# Altium schematic sheet ESP32_Dash_FCEM.SchDoc: Dashboard
size 594 x 420 mm; Date: 04/09/2021; Author: Mario Venere Neto; CompanyName: Formula CEM; DrawnBy: Mario Venere Neto; DocumentNumber: 1.0; Revision: 0; SheetNumber: 1; SheetTotal: 1; Time: 12:05; ImagePath: C:\Users\Lenovo\Documents\ESP32_Dash\SCH_Logo.png
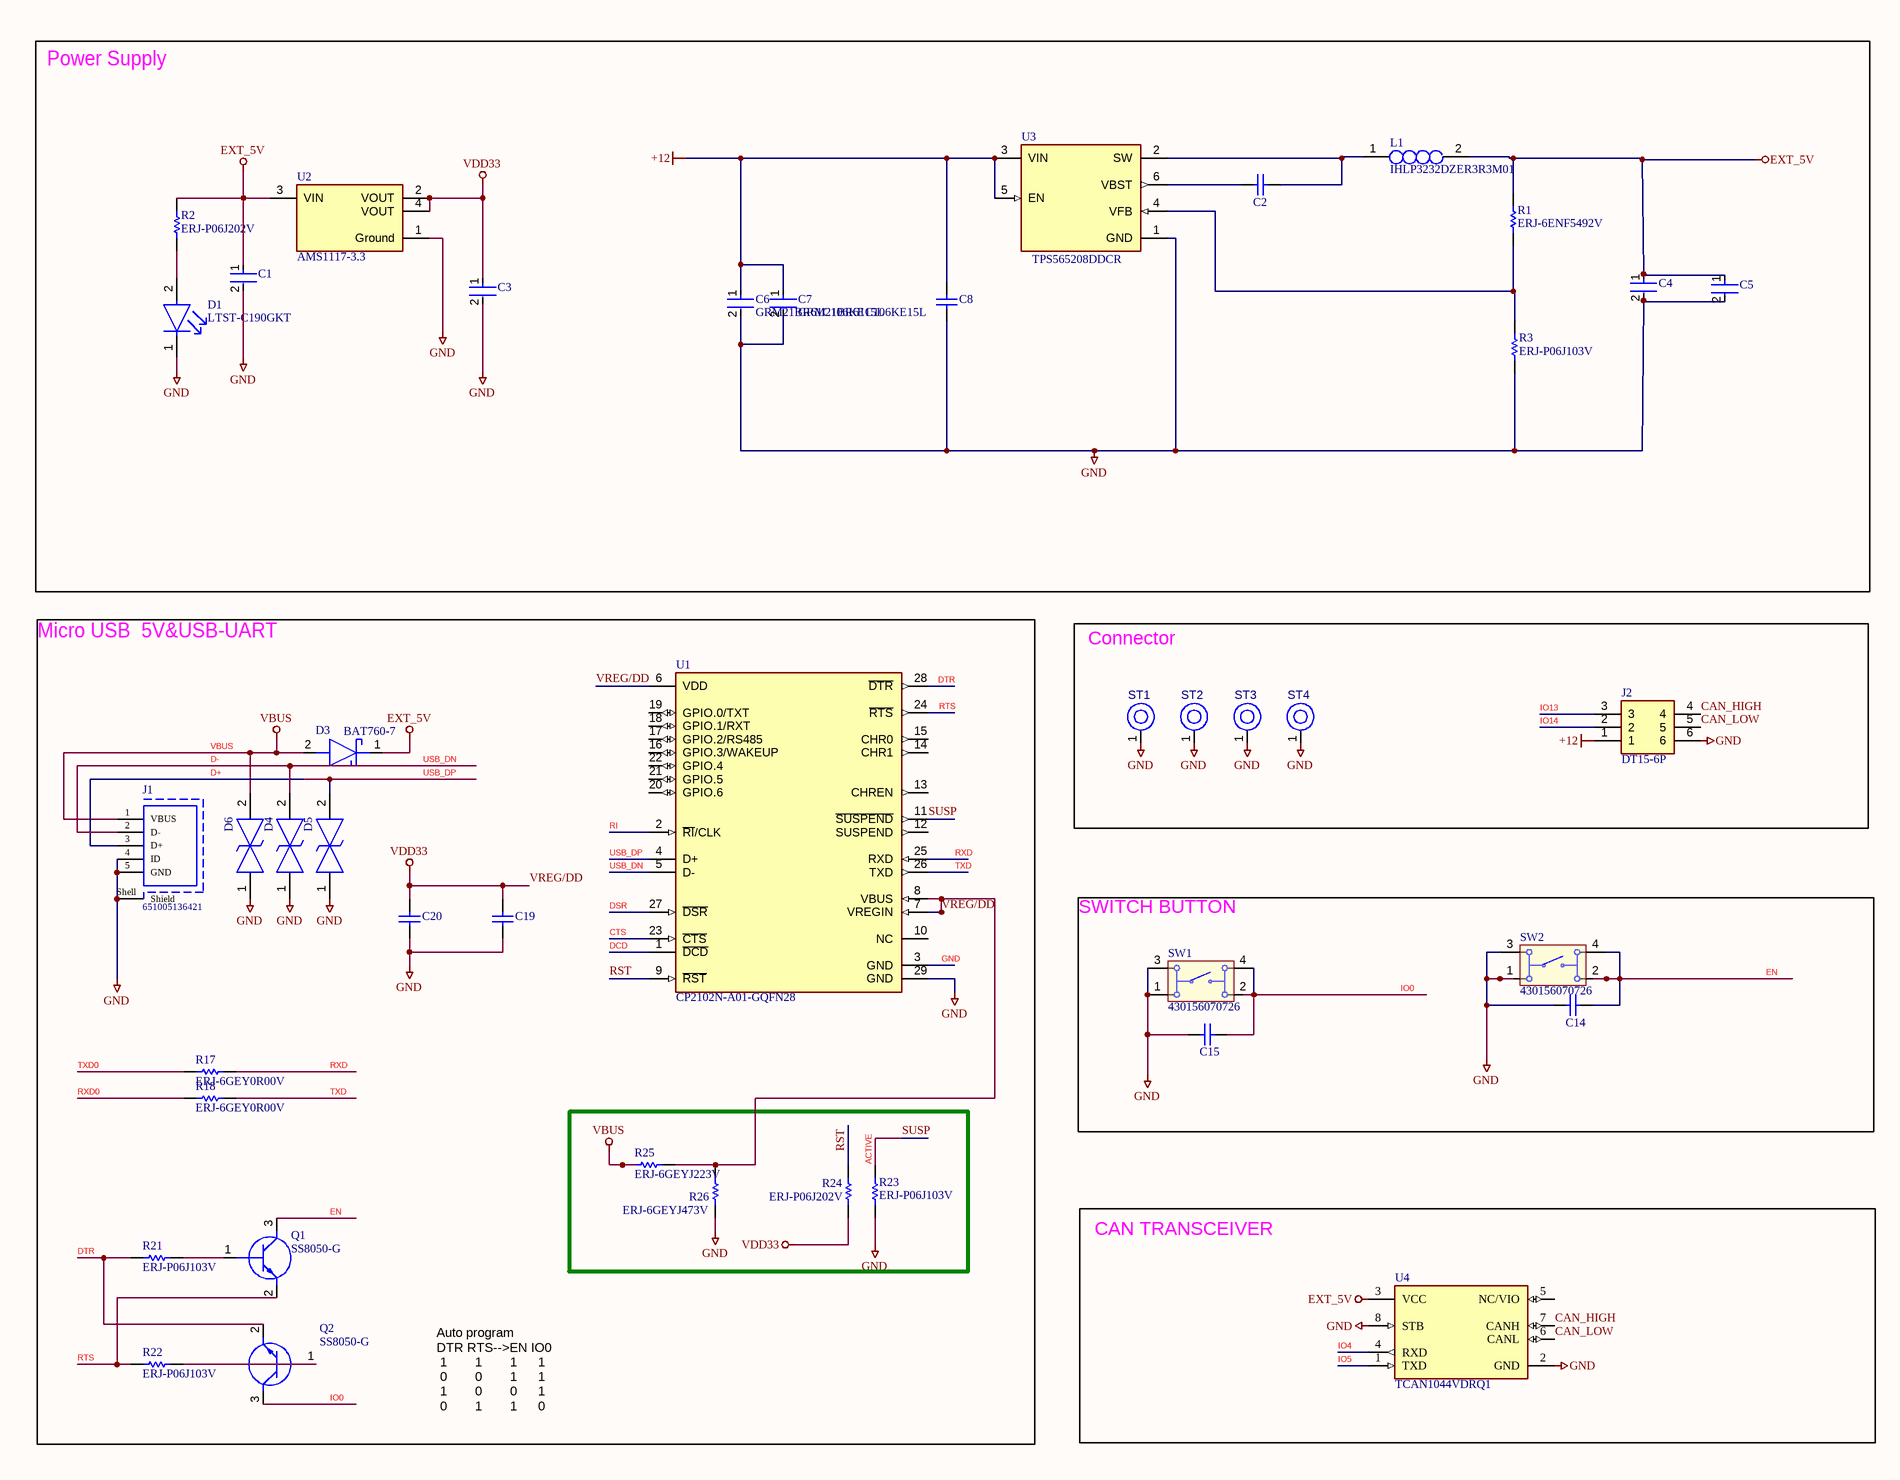
[diagram p0: ESP32_Dash_FCEM.SchDoc, left]
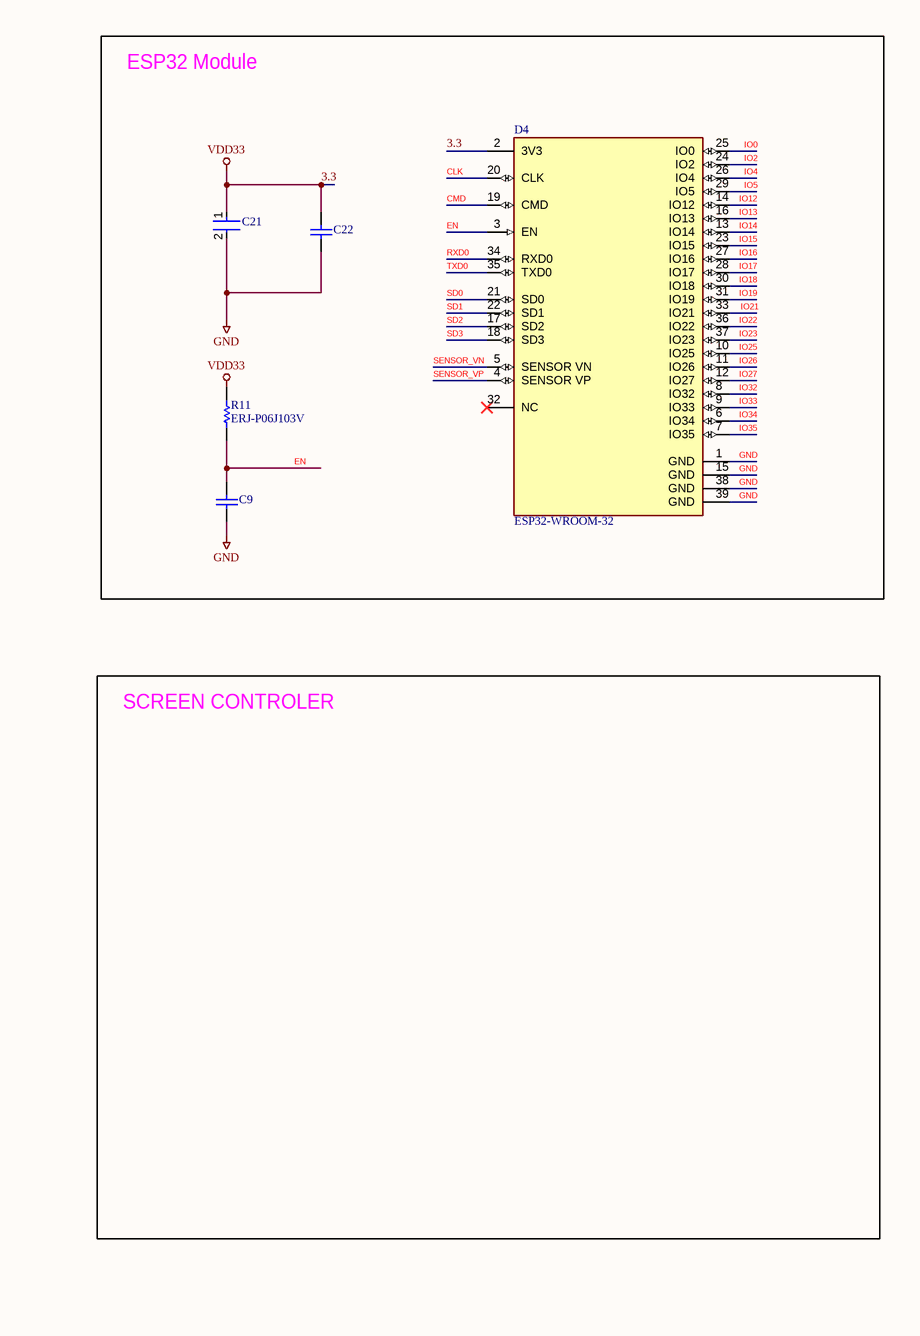
[diagram p1: ESP32_Dash_FCEM.SchDoc, right]

## Parts
(Parts that share a designator on the sheet are numbered #1, #2 ... from top to bottom, then left to right.)
C1  GRM21BR61A226ME51L  [FP-GRM21B-0_15-MFG]  (value not drawn)
C2  GRM21BR71H104KA01L  [CAPC2013X135X45ML10T25]  (value not drawn)
C3  GRM21BR61A226ME51L  [FP-GRM21B-0_15-MFG]  (value not drawn)
C4  GRM21BR61A226ME51L  [FP-GRM21B-0_15-MFG]  (value not drawn)
C5  GRM21BR61A226ME51L  [FP-GRM21B-0_15-MFG]  (value not drawn)
C6  GRM21BR61C106KE15L  [FP-GRM21B-0_1-IPC_C]
C7  GRM21BR61C106KE15L  [FP-GRM21B-0_1-IPC_C]
C8  GRM21BR71H104KA01L  [CAPC2013X135X45ML10T25]  (value not drawn)
C9  GRM21BR71H104KA01L  [CAPC2013X135X45ML10T25]  (value not drawn)
C14  GRM21BR71H104KA01L  [CAPC2013X135X45ML10T25]  (value not drawn)
C15  GRM21BR71H104KA01L  [CAPC2013X135X45ML10T25]  (value not drawn)
C19  GRM21BR71H104KA01L  [CAPC2013X135X45ML10T25]  (value not drawn)
C20  GRM21BR60J475KA11K  [CAPC2013X140X45NL15T25]  (value not drawn)
C21  GRM21BR61A226ME51L  [FP-GRM21B-0_15-MFG]  (value not drawn)
C22  GRM21BR71H104KA01L  [CAPC2013X135X45ML10T25]  (value not drawn)
D1  LTST-C190GKT  [FP-LTST-C190GKT-MFG]
D3  BAT760-7  [SOD2513X120N]
D4#1  ESP32-WROOM-32  [FP-ESP32-WROOM-32-MFG]
D4#2  LESD5D5.0CT1G  [LESD5D50CT1G]  (value not drawn)
D5  LESD5D5.0CT1G  [LESD5D50CT1G]  (value not drawn)
D6  LESD5D5.0CT1G  [LESD5D50CT1G]  (value not drawn)
J1  651005136421  [651005136421]
J2  DT15-6P  [DT156P]
L1  IHLP3232DZER3R3M01  [INDPM8682X400N]
Q1  SS8050-G  [SOT95P240X115-3N]
Q2  SS8050-G  [SOT95P240X115-3N]
R1  ERJ-6ENF5492V  [RESC2013X70X40LL20T20]
R2  ERJ-P06J202V  [RESC2013X70X40LL20T20]
R3  ERJ-P06J103V  [RESC2013X70X40ML20T20]
R11  ERJ-P06J103V  [RESC2013X70X40ML20T20]
R17  ERJ-6GEY0R00V  [RESC2013X70X40NL20T20]
R18  ERJ-6GEY0R00V  [RESC2013X70X40NL20T20]
R21  ERJ-P06J103V  [RESC2013X70X40ML20T20]
R22  ERJ-P06J103V  [RESC2013X70X40ML20T20]
R23  ERJ-P06J103V  [RESC2013X70X40ML20T20]
R24  ERJ-P06J202V  [RESC2013X70X40LL20T20]
R25  ERJ-6GEYJ223V  [RESC2013X70X40NL20T20]
R26  ERJ-6GEYJ473V  [RESC2013X70X40ML20T20]
ST1  PTH-M2D5X5  [PTH-M2D5X5]  (value not drawn)
ST2  PTH-M2D5X5  [PTH-M2D5X5]  (value not drawn)
ST3  PTH-M2D5X5  [PTH-M2D5X5]  (value not drawn)
ST4  PTH-M2D5X5  [PTH-M2D5X5]  (value not drawn)
SW1  430156070726  [430156070726]
SW2  430156070726  [430156070726]
U1  CP2102N-A01-GQFN28  [FP-CP2102N-A01-GQFN28-MFG]
U2  AMS1117-3.3  [FP-AMS1117-IPC_C]
U3  TPS565208DDCR  [FP-DDC0006A-IPC_A]
U4  TCAN1044VDRQ1  [FP-D0008A-IPC_C]

## Blocks framed on the sheet
Power Supply: C1-C8 D1 L1 R1-R3 U2 U3
ESP32 Module: C9 C21 C22 D4#1 R11
Micro USB  5V&USB-UART: C19 C20 D3 D4#2 D5 D6 J1 Q1 Q2 R17 R18 R21-R26 U1
Connector: J2 ST1-ST4
SWITCH BUTTON: C14 C15 SW1 SW2
CAN TRANSCEIVER: U4

## Nets
3.3: C3.1 C19.2 C20.2 C21.1 C22.2 D4#1.2(3V3) R11.2 R24.1 R25.2 R26.2 U1.6(VDD) U1.7(VREGIN) U1.8(VBUS) U2.2(VOUT) U2.4(VOUT)  [also labelled VDD33, VREG/DD]
+12: C6.1 C7.1 C8.2 J2.1 U3.3(VIN) U3.5(EN)
EXT_5V: C1.1 C4.1 C5.1 D3.1(K) L1.2 R1.2 R2.2 U2.3(VIN) U4.3(VCC)
GND: C1.2 C3.2 C4.2 C5.2 C6.2 C7.2 C8.1 C9.1 C14.2 C15.1 C19.1 C20.1 C21.2 C22.1 D1.1(C) D4#1.1(GND) D4#1.15(GND) D4#1.38(GND) D4#1.39(GND) D4#2.1 D5.1 D6.1 J1.4(ID) J1.5(GND) J1.Shell(Shield) J2.6 R3.1 R23.1 R26.1 ST1.1(H1) ST2.1(H1) ST3.1(H1) ST4.1(H1) SW1.1 SW1.3 SW2.1 SW2.3 U1.3(GND) U1.29(GND) U2.1(Ground) U3.1(GND) U4.2(GND) U4.8(STB)
VBUS: D3.2(A) D6.2 J1.1(VBUS) R25.1
ACTIVE: R23.2 U1.11(~{SUSPEND})  [also labelled SUSP]
CAN_HIGH: J2.4 U4.7(CANH)
CAN_LOW: J2.5 U4.6(CANL)
CLK: D4#1.20(CLK)
CMD: D4#1.19(CMD)
CTS: U1.23(~{CTS})
D+: D5.2 J1.3(D+) U1.4(D+)  [also labelled USB_DP]
D-: D4#2.2 J1.2(D-) U1.5(D-)  [also labelled USB_DN]
DCD: U1.1(~{DCD})
DSR: U1.27(~{DSR})
DTR: Q2.2(E) R21.1 U1.28(~{DTR})
EN: C9.2 C14.1 D4#1.3(EN) Q1.3(C) R11.1 SW2.2 SW2.4
IO0: C15.2 D4#1.25(IO0) Q2.3(C) SW1.2 SW1.4
IO2: D4#1.24(IO2)
IO4: D4#1.26(IO4) U4.4(RXD)
IO5: D4#1.29(IO5) U4.1(TXD)
IO12: D4#1.14(IO12)
IO13: D4#1.16(IO13) J2.3
IO14: D4#1.13(IO14) J2.2
IO15: D4#1.23(IO15)
IO16: D4#1.27(IO16)
IO17: D4#1.28(IO17)
IO18: D4#1.30(IO18)
IO19: D4#1.31(IO19)
IO21: D4#1.33(IO21)
IO22: D4#1.36(IO22)
IO23: D4#1.37(IO23)
IO25: D4#1.10(IO25)
IO26: D4#1.11(IO26)
IO27: D4#1.12(IO27)
IO32: D4#1.8(IO32)
IO33: D4#1.9(IO33)
IO34: D4#1.6(IO34)
IO35: D4#1.7(IO35)
RI: U1.2(~{RI}/CLK)
RST: R24.2 U1.9(~{RST})
RTS: Q1.2(E) R22.1 U1.24(~{RTS})
RXD: R17.2 U1.25(RXD)
RXD0: D4#1.34(RXD0) R18.1
SD0: D4#1.21(SD0)
SD1: D4#1.22(SD1)
SD2: D4#1.17(SD2)
SD3: D4#1.18(SD3)
SENSOR_VN: D4#1.5(SENSOR_VN)
SENSOR_VP: D4#1.4(SENSOR_VP)
TXD: R18.2 U1.26(TXD)
TXD0: D4#1.35(TXD0) R17.1
NetC2_1: C2.1 L1.1 U3.2(SW)
NetC2_2: C2.2 U3.6(VBST)
NetD1_2: D1.2(A) R2.1
NetQ1_1: Q1.1(B) R21.2
NetQ2_1: Q2.1(B) R22.2
NetR1_1: R1.1 R3.2 U3.4(VFB)

Not connected (* = marked no-connect by the designer): D4#1 32(NC)*; U1 10(NC) 12(SUSPEND) 13(CHREN) 14(CHR1) 15(CHR0) 16(GPIO.3/WAKEUP) 17(GPIO.2/RS485) 18(GPIO.1/RXT) 19(GPIO.0/TXT) 20(GPIO.6) 21(GPIO.5) 22(GPIO.4); U4 5(NC/VIO)

## Notes on the sheet
- SCREEN CONTROLER
- Auto program
  DTR RTS-->EN IO0
  1        1        1      1
  0        0        1      1
  1        0        0      1
  0        1        1      0
- DWG NO:
- REV:
- THIS DOCUMENT AND THE DATA DISCLOSED HEREIN OR
- HEREWITH IS THE PROPERTY OF ALTIUM LIMITED AND MAY
- BE FREELY DISTRIBUTED IN WHOLE. NO RIGHTS ARE
- RESERVED OR EXPRESS OR IMPLIED WARANTEE GIVEN.
- REVISION
- DESCRIPTION
- DATE
- APPROVED
- ENG:
- APPROVALS
- PROJECT
- DSN:
- CHK:
- REFERENCE DOCUMENTS
- PROJECT REVISION:
- TITLE
- DOCUMENT REVISION:
- DESIGN ITEM:
- BOM:
- FAB DWG:
- PCB DWG:
- ASSY DWG:
- SCALE:
- A2
- SIZE
- CAGE CODE
- FILE NAME
- DWG NO.
- SHEET
- OF
- REV

## Library data of the parts
C1 C3-C5 C21 = CMP-2000-06340-2: Chip Multilayer Ceramic Capacitors for General Purpose, 0805, 22uF, X5R, 15%, 20%, 10V; Thickness: 0.055inch; Length: 2mm; Tolerance: 20%; Max Operating Temperature: 85°C; REACH SVHC: No SVHC; Capacitance: 22uF; Voltage Rating: 10V; Radiation Hardening: No; Weight: 0.000335oz; Case Code (Metric): 2012; Case Code (Imperial): 0805; Height: 1.25mm; Min Operating Temperature: -55°C; Voltage Rating (DC): 10V; Lead Free: Lead Free; Package Quantity: 3000; Case/Package: 0805; Dielectric: X5R; Mount: Surface Mount; Termination: SMD/SMT; Width: 0.049inch; Depth: 1.25mm; Packaging: Tape and Reel; Value: 22uF
C2 C8 C9 C14 C15 C19 C22 = CMP-2100-03644-1: Chip Capacitor, 0.1 uF, +/- 10%, 50 V, -55 to 125 degC, 0805 (2012 Metric), RoHS, Tape and Reel; Manufacturer: Murata; Voltage: 50V; Capacitance: 100nF; Insulation Resistance: 10GR; Dielectric Material: Ceramic; Dielectric: X7R; Value: 100nF; Package Description: 2-Pin Surface Mount Device, Body 2 x 1.25 mm; Manufacturer URL: http://www.murata.com/; Case Code (Imperial): 0805; Datasheet URL: http://psearch.en.murata.com/capacitor/product/GRM21BR71H104KA01%23.pdf; Termination: SMD/SMT; Lead Free: LeadFree; Package Quantity: 1; Mount: SurfaceMount; REACH SVHC: Unknown; Thickness: 0.053inch; Height: 1.25mm; Case/Package: 0805; Voltage Rating: 50V; Width: 0.049inch; Case Code (Metric): 2012; Material: Ceramic; Min Operating Temperature: -55degC; RoHSCompliant: true; Datasheet Version: 42675.0; Voltage Rating (DC): 50V; Tolerance: 10%; Package Reference: 0805; Depth: 1.25mm; Length: 2mm; Max Operating Temperature: 125degC; Packaging: TapeandReel; Number of Pins: 2; Radiation Hardening: No
C6 C7 = CMP-2007-03453-2: Chip Multilayer Ceramic Capacitors for General Purpose, 0805, 10uF, X5R, 15%, 10%, 16V; Radiation Hardening: No; Thickness: 0.053inch; Voltage Rating (DC): 16V; Lead Free: Lead Free; Package Quantity: 1; Width: 1.25mm; Case Code (Imperial): 0805; Depth: 1.25mm; Packaging: Tape and Reel; Dielectric: X5R; Max Operating Temperature: 85°C; Tolerance: 10%; Voltage Rating: 16V; Voltage: 16V; Capacitance: 10uF; Height: 1.25mm; Case Code (Metric): 2012; Material: Ceramic; Mount: Surface Mount; Case/Package: 0805; REACH SVHC: No SVHC; Length: 2mm; Min Operating Temperature: -55°C; Termination: SMD/SMT; Value: 10uF
C20 = CMP-2007-03388-1: Manufacturer: Murata; Value: 1n; Part Number: GRM21BR60J475KA11K
D1 = CMP-22017-000005-2: LED GREEN CLEAR CHIP SMD; Dominant Wavelength: 569nm; Reverse Voltage: 5V; Lens Color: Colorless; Viewing Angle: 130°; Voltage: 2V; Forward Current: 30mA; Power Dissipation: 100mW; Luminous Intensity: 6mcd; Number of LEDs: 1; Forward Voltage: 2.1V; Wavelength: 565nm; Test Current: 10mA; Min Operating Temperature: -55°C; Lens Style: Clear; Mount: Surface Mount; Width: 0.8mm; Packaging: Tape and Reel; Lens Transparency: Clear; Case Code (Metric): 1608; Depth: 0.8mm; Case Code (Imperial): 0603; Case/Package: 0603; Number of Pins: 2; Max Operating Temperature: 85°C; Lead Free: Lead Free; Number of Elements: 1; Length: 1.6mm; Height: 0.8mm; Package Quantity: 1; Power Rating: 100mW; Radiation Hardening: No; Illumination Color: Green; Color: Green
D3 = BAT760-7: Schottky Diode; Manufacturer_Name: Diodes Inc.; Datasheet Link: https://www.diodes.com/assets/Datasheets/ds30498.pdf; Height: 1.2mm; Manufacturer_Part_Number: BAT760-7; Mouser Part Number: 621-BAT760-7; Mouser Price/Stock: https://www.mouser.co.uk/ProductDetail/Diodes-Incorporated/BAT760-7?qs=JV7lzlMm3yKDDyO09xoRbQ%3D%3D; Arrow Part Number: BAT760-7; Arrow Price/Stock: https://www.arrow.com/en/products/bat760-7/diodes-incorporated?region=europe
D4#1 = CMP-194065-000008-1: RX TXRX MOD WIFI SURFACE MOUNT; Frequency: 2.5GHz; Sensitivity: -98dBm; Operating Supply Voltage: 3.6V; Data Rate: 150Mbps; Weight: 0.088185oz; Package Quantity: 550; Min Operating Temperature: -40°C; Mount: Surface Mount; Max Operating Temperature: 85°C; Packaging: Cut Tape; Case/Package: SMD/SMT
D4#2 D5 D6 = LESD5D5.0CT1G: TVS Diode (Bi-directional); Manufacturer_Name: LRC; Datasheet Link: http://www.lrcls.com/data/pdf/LESD5D5.0CT1G.pdf; Height: 0.7mm; Manufacturer_Part_Number: LESD5D5.0CT1G
J1 = CMP-1502-03248-1: Mini USB 2.0 Type B Receptacle WR-COM, Vertical, THT; Manufacturer: Wurth Elektronik; Rated Current: 1A; Working Voltage: 30VAC; Contact Resistance: 20mOhm; Gender: Receptacle; Part Number: 651005136421; Package Reference: 651005136421; Datasheet URL: https://katalog.we-online.de/em/datasheet/651005136421%282%29.pdf; Publisher: WurthElektronik; Operating Temperature: -40to105degC; Connector Type: MiniUSB2.0TypeB; Packaging: Tray; Mounting Technology: THT; Manufacturer URL: http://www.we-online.de; Orientation: Vertical
J2 = DT15-6P: Connector; Manufacturer_Name: TE Connectivity; Datasheet Link: http://www.mouser.com/ds/2/418/NG_CD_DT15-6P_C1-960750.pdf; Height: 30.99mm; Manufacturer_Part_Number: DT15-6P; Mouser Part Number: 571-DT15-6P; Mouser Price/Stock: https://www.mouser.co.uk/ProductDetail/TE-Connectivity-DEUTSCH/DT15-6P?qs=vkMqrgFpRairOlMBPMX7lA%3D%3D
L1 = IHLP3232DZER3R3M01: Inductor; Manufacturer_Name: Vishay; Value: 1u; Datasheet Link: https://www.vishay.com/docs/34316/ihlp-3232dz-01.pdf; Height: 4mm; Manufacturer_Part_Number: IHLP3232DZER3R3M01; Mouser Part Number: 70-IHLP3232DZER3R3M0; Mouser Price/Stock: https://www.mouser.co.uk/ProductDetail/Vishay-Dale/IHLP3232DZER3R3M01?qs=IyEhILxByaPZ47o12iE%252BuQ%3D%3D; Arrow Part Number: IHLP3232DZER3R3M01; Arrow Price/Stock: https://www.arrow.com/en/products/ihlp3232dzer3r3m01/vishay?region=nac
Q1 Q2 = SS8050-G: Transistor BJT NPN; Manufacturer_Name: Comchip Technology; Datasheet Link: http://www.comchiptech.com/admin/files/product/SS8050-G%20RevA181526.pdf; Height: 1.15mm; Manufacturer_Part_Number: SS8050-G; Mouser Part Number: 750-SS8050-G; Mouser Price/Stock: https://www.mouser.co.uk/ProductDetail/Comchip-Technology/SS8050-G?qs=LLUE9lz1YbcHg%252BWLMAtcrQ%3D%3D; Arrow Part Number: SS8050-G; Arrow Price/Stock: https://www.arrow.com/en/products/ss8050-g/comchip-technology?region=nac
R1 = CMP-2001-00233-1: Manufacturer: Panasonic; Value: 1K; Part Number: ERJ-6ENF5492V
R2 R24 = CMP-2001-00483-1: Manufacturer: Panasonic; Value: 1K; Part Number: ERJ-P06J202V
R3 R11 R21-R23 = CMP-2001-00478-1: Manufacturer: Panasonic; Value: 1K; Part Number: ERJ-P06J103V
R17 R18 = CMP-1665-00002-5: Chip Resistor, 0 Ohm, +/- 1%, 0.125 W, -55 to 155 degC, 0805 (2012 Metric), RoHS, Tape and Reel; Tolerance: 5%; Resistance: 0 Ohm; Value: 0 Ohm; REACH SVHC: No SVHC; Min Operating Temperature: -55 degC; Case/Package: 0805; Packaging: Tape and Reel; Package Quantity: 5000; ComponentLink1Description: Manufacturer URL; PackageDescription: 2-Pin Surface Mount Device, Body 2 x 1.25 mm; Mounting Technology: Surface Mount; Max Operating Temperature: 155 degC; PartNumber: ERJ-6GEY0R00V; Width: 1.25 mm; RoHSCompliant: True; Height: 0.6 mm; ComponentLink1URL: http://www.panasonic.com/; ComponentLink2URL: http://industrial.panasonic.com/cdbs/www-data/pdf/RDA0000/AOA0000C84.pdf; Case Code (Imperial): 0805; DatasheetVersion: 03/2015; Length: 2 mm; Case Code (Metric): 2012; ComponentLink2Description: Datasheet; Radiation Hardening: No
R25 = CMP-2001-00377-1: Manufacturer: Panasonic; Value: 1K; Part Number: ERJ-6GEYJ223V
R26 = CMP-2001-00421-1: Manufacturer: Panasonic; Value: 1K; Part Number: ERJ-6GEYJ473V
ST1-ST4 = CMP-00028-00004-1: M2 PTH (2.5mm), 5mm pad; Pins: 1
SW1 SW2 = CMP-1453-00005-1: WS-TATV THT Tact Switch 6X6 mm; Manufacturer: Wuerth Elektronik; NoPins: 04; ComponentLink1URL: http://www.we-online.com; ComponentLink2URL: http://katalog.we-online.de/em/datasheet/4301x6.pdf; ComponentLink1Description: Manufacturer URL; PackageReference: 430156070726; ComponentLink2Description: Datasheet; PartNumber: 430156070726
U1 = CMP-08093-000004-1: IC BRIDGE USB TO UART 28QFN; Manufacturer: Silicon Labs; Standoff Height: 0mm; Max Junction Temp: +105°C; Usb Standard: USB 2.0; Number Of Ports: 1; Nominal Supply Current: 195-13700uA; Min Supply Voltage: 1.71V; Max Supply Voltage: 5.25V; Interface: UART,USB,RS-232,RS-485; Height: 0.8mm; Package: CP2102N-A01-GQFN28; Temperature Range Low: -40°C; Lead Free: Yes; Category: IC; Ambient Temperature Range High: +85°C; Device Class L3: USB Interface ICs; Octopart: https://octopart.com/cp2102n-a01-gqfn28-silicon+labs-74636024; Manufacturer Part Number: CP2102N-A01-GQFN28; Device Class L2: Interface ICs; ComponentLink2URL: https://media.digikey.com/pdf/Data%20Sheets/Silicon%20Laboratories%20PDFs/CP2102N_Rev.1.3_DS.pdf; Automotive: No; Temperature: -40°C to +85°C; Device Class L1: Integrated Circuits (ICs); Mouser Description: IC BRIDGE USB TO UART 28QFN; RoHS: TRUE; Ambient Temperature Range Low: -40°C; Temperature Range High: +85°C; Ipc Land Pattern Name: QFN50P500X500X75-28; Digikey Description: IC BRIDGE USB TO UART 28QFN; ComponentLink2Description: Datasheet
U2 = CMP-209535-000001-1: LDO Voltage Regulators 1A, 3.3V; Manufacturer: Advanced Monolithic Systems; Dropout Voltage: 1.1V; Output Type: Fixed; Nominal Supply Current: 5mA; Max Power Dissipation: 1.2W; Max Supply Voltage: 15V; Number Of Outputs: 1; Standoff Height: 0.64mm; Max Junction Temp: +125°C; Height: 1.8mm; Package: AMS1117; Device Class L2: Power Management ICs; ComponentLink2Description: Datasheet; ComponentLink2URL: http://www.advanced-monolithic.com/pdf/ds1117.pdf; Category: IC; RoHS: TRUE; Automotive: No; Device Class L1: Integrated Circuits (ICs); Output Current: 1A; Device Class L3: Voltage Regulators - Linear; Temperature: -40°C to +125°C; Output Voltage: 3.3V; Manufacturer Part Number: AMS1117-3.3; Temperature Range Low: -40°C; Octopart: https://octopart.com/ams1117-3.3-advanced+monolithic+systems-25899300; Lead Free: Yes; Ipc Land Pattern Name: SOT229P700X180-4; Temperature Range High: +125°C
U3 = CMP-04918-000154-1: IC REG BUCK ADJ 5A TSOT23-6; Min Input Voltage: 4.5V; Min Output Voltage: 760mV; Output Configuration: Positive; Max Output Voltage: 7V; Number of Outputs: 1; Synchronous Rectifier: Yes; Switching Frequency: 500kHz; Max Input Voltage: 17V; Output Type: Adjustable; Mount: Surface Mount; Number of Pins: 6; Case/Package: SOT-23-6; Min Operating Temperature: -40°C; Output Current: 5A; Packaging: Tape and Reel; Max Operating Temperature: 125°C
U4 = CMP-04872-000112-1: CAN XCVR WITH OPTIONAL FD; RoHS Compliant: Yes